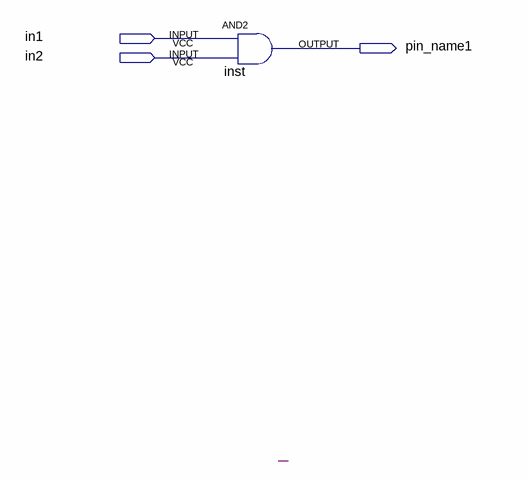
[diagram p0: schematic sheet]
// Quartus schematic congAND.bdf as structural Verilog: 1 symbols, 3 pins
module congAND (
  input  in1,
  input  in2,
  output pin_name1
);

  and inst (pin_name1, in1, in2);
endmodule
